# EAGLE design music_visualizer (EAGLE 9.5.1)
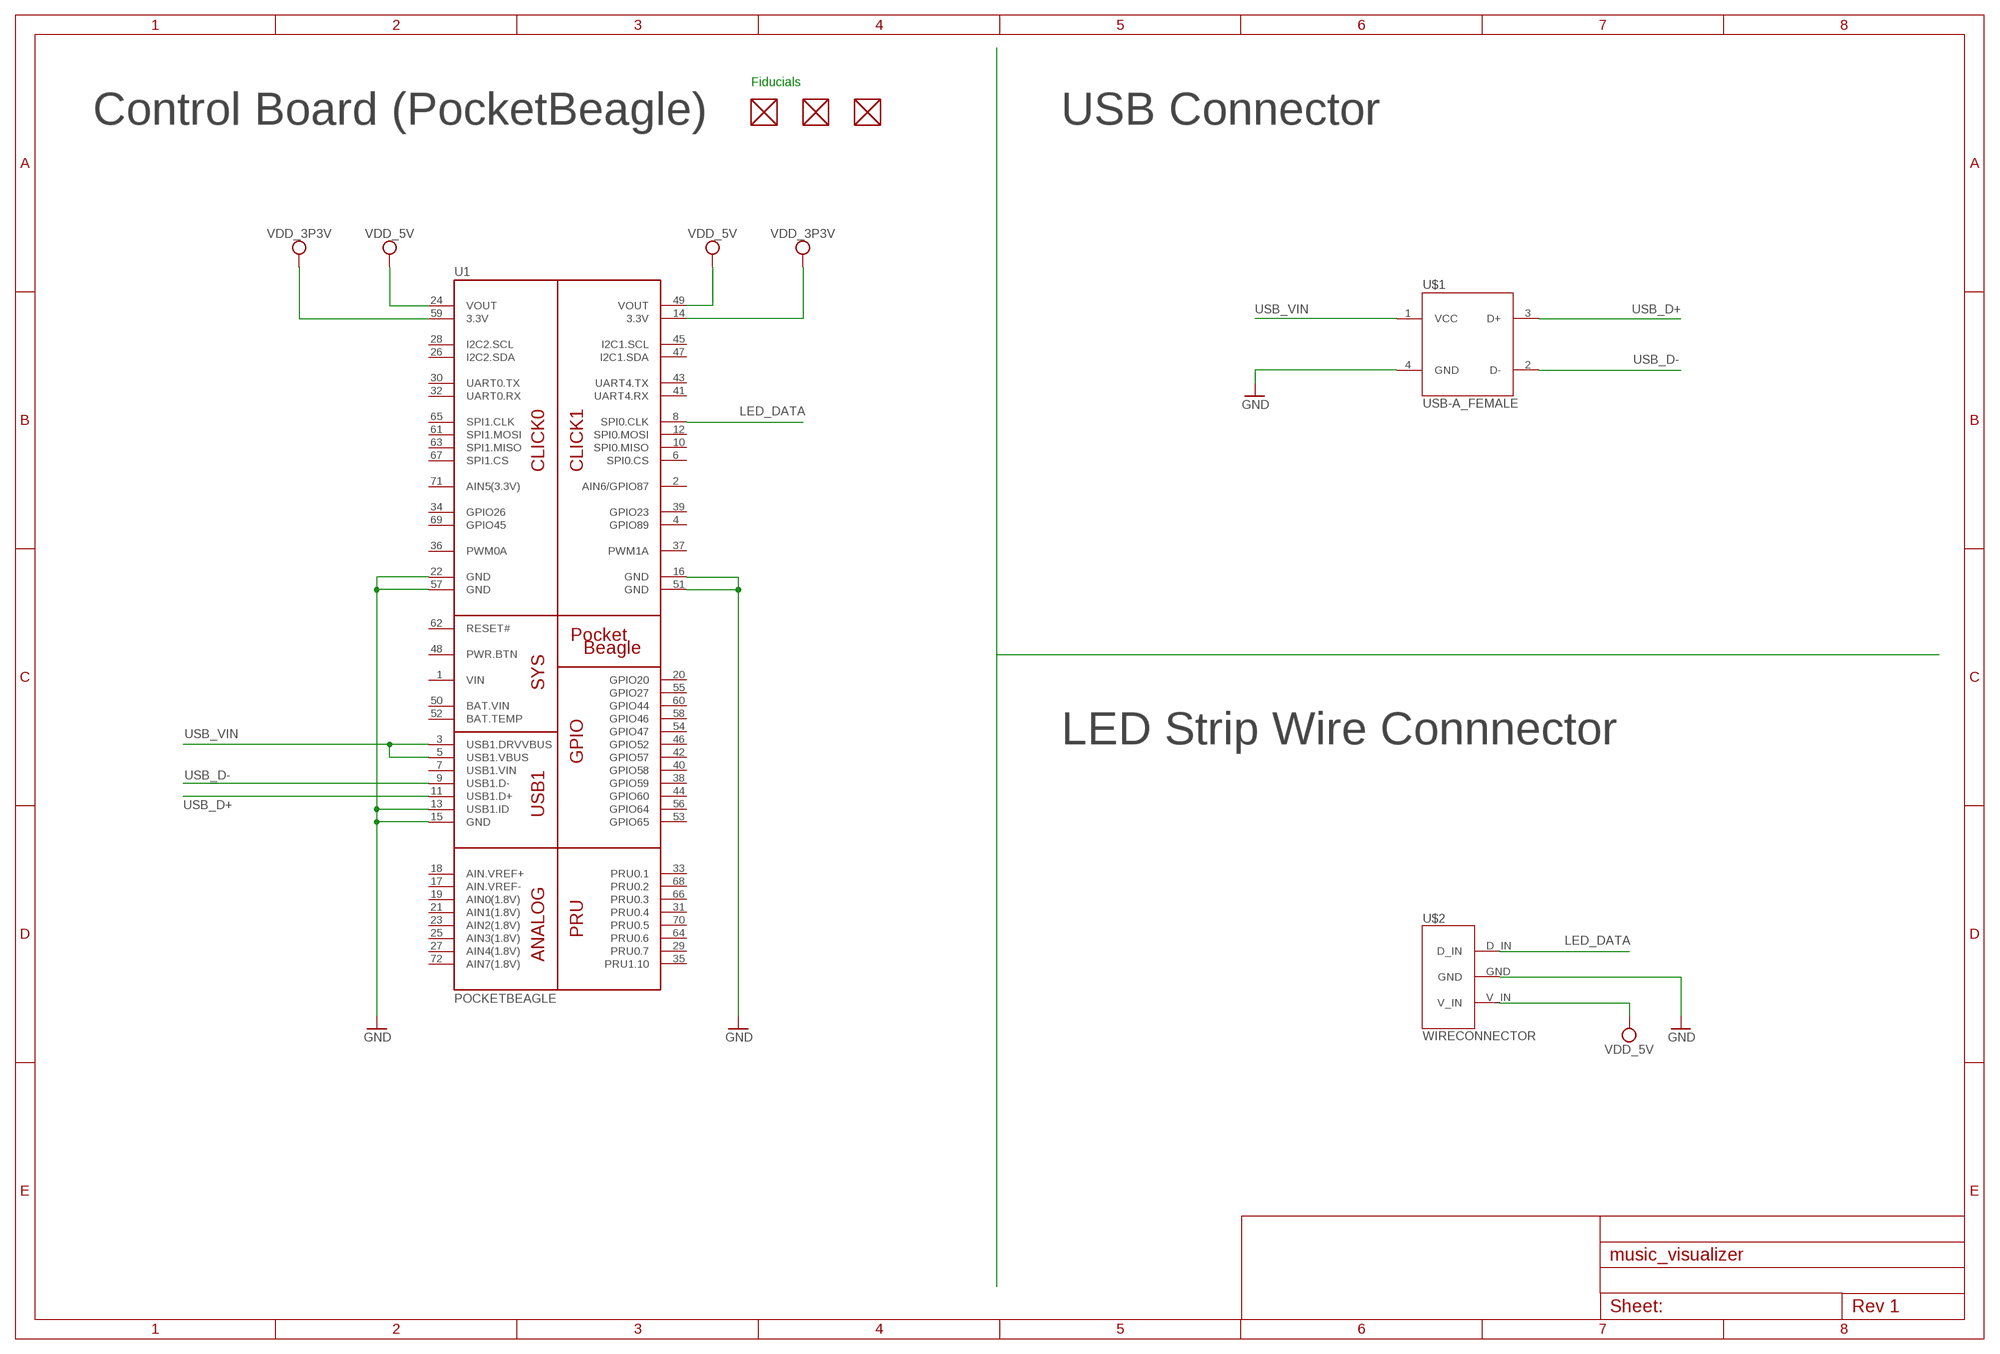
[diagram p0: schematic, sheet 1]

## Parts
FUD1  FIDUCIAL  [FIDUCIAL_40MIL]
FUD2  FIDUCIAL  [FIDUCIAL_40MIL]
FUD3  FIDUCIAL  [FIDUCIAL_40MIL]
U1  POCKETBEAGLE  [POCKETBEAGLE]
U$1  USB-A_FEMALE  [USB-A_FEMALE]
U$2  WIRECONNECTOR  [WIRECONNECTOR]

## Nets
GND: U1.13(USB1.ID) U1.15(GND) U1.16(GND) U1.22(GND) U1.51(GND) U1.57(GND) U$1.4(GND) U$2.GND
LED_DATA: U1.8(SPI0.CLK) U$2.D_IN
USB_D+: U1.11(USB1.D+) U$1.3(D+)
USB_D-: U1.9(USB1.D-) U$1.2(D-)
USB_VIN: U1.3(USB1.DRVVBUS) U1.5(USB1.VBUS) U$1.1(VCC)
VDD_3P3V: U1.14(3.3V) U1.59(3.3V)
VDD_5V: U1.24(VOUT) U1.49(VOUT) U$2.V_IN
Unconnected: FUD1.P$1 FUD2.P$1 FUD3.P$1 U1.2(AIN6/GPIO87) U1.4(GPIO89) U1.6(SPI0.CS) U1.7(USB1.VIN) U1.10(SPI0.MISO) U1.12(SPI0.MOSI) U1.17(AIN.VREF-) U1.18(AIN.VREF+) U1.19(AIN0(1.8V)) U1.20(GPIO20) U1.21(AIN1(1.8V)) U1.23(AIN2(1.8V)) U1.25(AIN3(1.8V)) U1.26(I2C2.SDA) U1.27(AIN4(1.8V)) U1.28(I2C2.SCL) U1.29(PRU0.7) U1.30(UART0.TX) U1.31(PRU0.4) U1.32(UART0.RX) U1.33(PRU0.1) U1.34(GPIO26) U1.35(PRU1.10) U1.36(PWM0A) U1.37(PWM1A) U1.38(GPIO59) U1.39(GPIO23) U1.40(GPIO58) U1.41(UART4.RX) U1.42(GPIO57) U1.43(UART4.TX) U1.44(GPIO60) U1.45(I2C1.SCL) U1.46(GPIO52) U1.47(I2C1.SDA) U1.48(PWR.BTN) U1.52(BAT.TEMP) U1.53(GPIO65) U1.54(GPIO47) U1.55(GPIO27) U1.56(GPIO64) U1.58(GPIO46) U1.60(GPIO44) U1.61(SPI1.MOSI) U1.62(RESET#) U1.63(SPI1.MISO) U1.64(PRU0.6) U1.65(SPI1.CLK) U1.66(PRU0.3) U1.67(SPI1.CS) U1.68(PRU0.2) U1.69(GPIO45) U1.70(PRU0.5) U1.71(AIN5(3.3V)) U1.72(AIN7(1.8V))

## Notes on the sheet
- Fiducials
- Control Board (PocketBeagle) | USB Connector
- LED Strip Wire Connnector

## Power pins joined to a net without a drawn wire
BAT.VIN: U1.50(BAT.VIN)
VIN: U1.1(VIN)

## Library data of the parts
FUD1-FUD3 = music_visualizer:FIDUCIAL
U1 = music_visualizer:POCKETBEAGLE
U$1 = music_visualizer:USB-A_FEMALE
U$2 = music_visualizer:WIRECONNECTOR

## Net classes
0 default: width 0.254 mm, drill 0.305 mm, clearance 0.254 mm

## Board
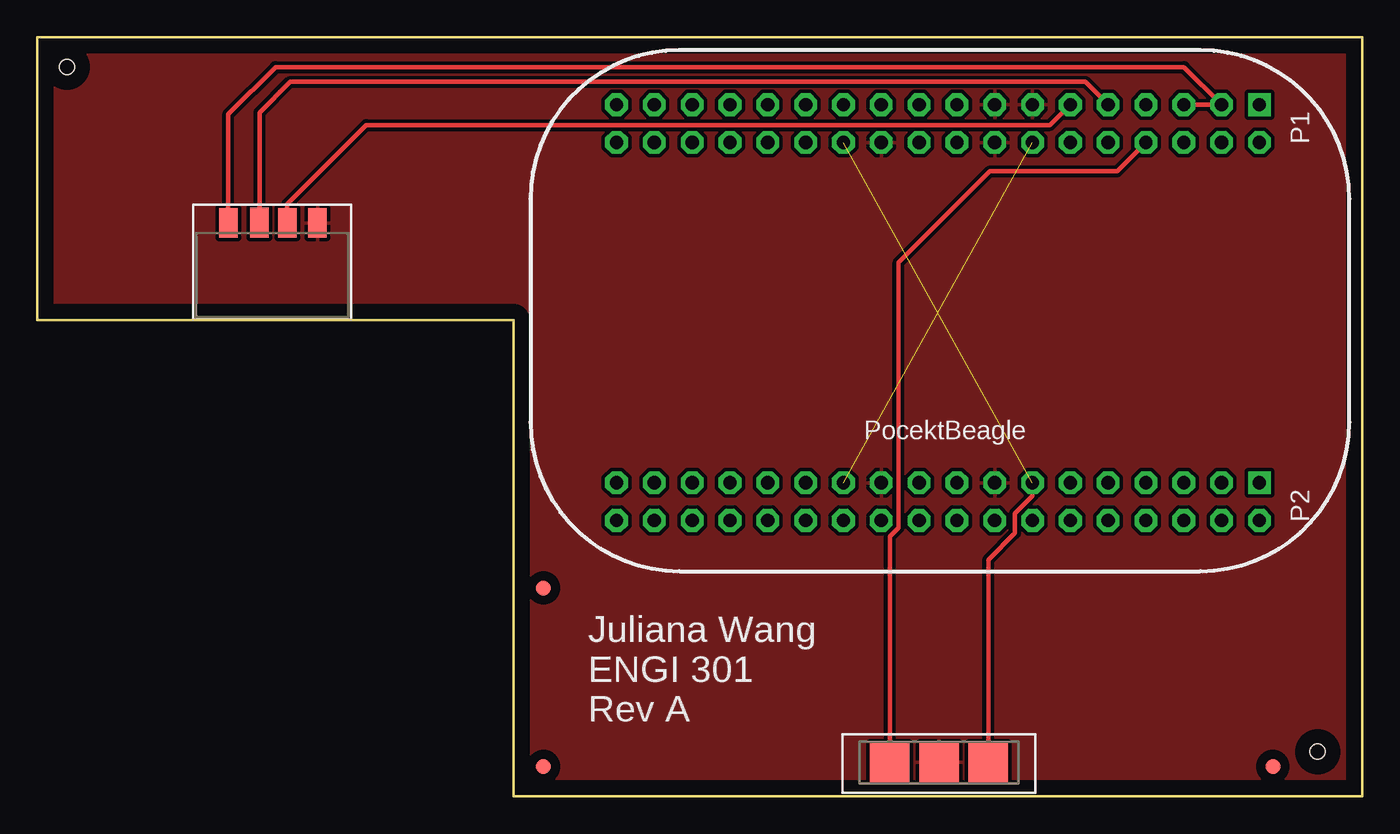
[diagram p1: board, top side]
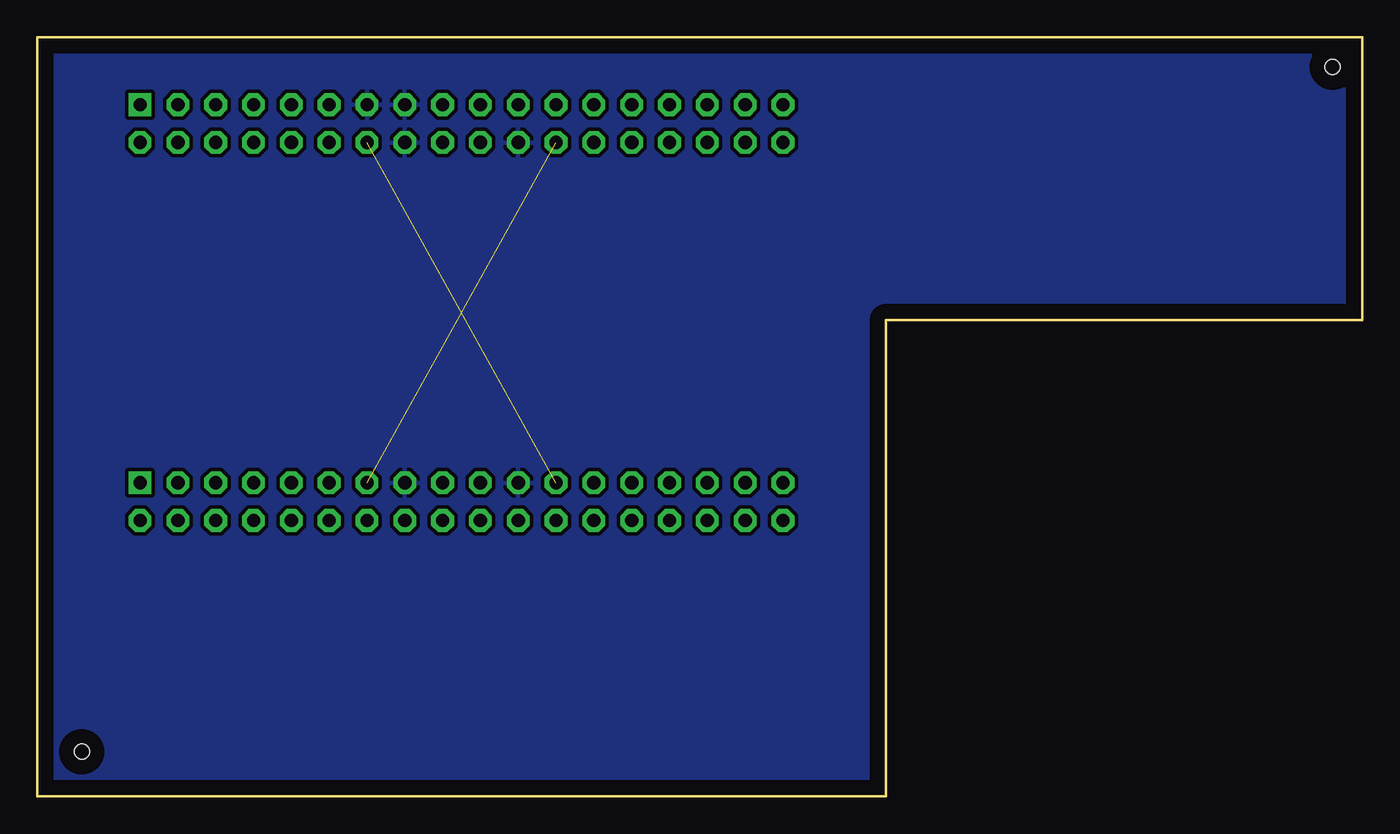
[diagram p2: board, bottom side, seen from below]

Size 89 x 51 mm. Coordinates in mm from the lower left corner, seen from the top.
Outline: 0,32 0,51 89,51 89,0 32,0 32,32 0,32
Copper layers (1*16): Top 0.035mm / dielectric 1.5mm / Bottom 0.035mm
Design rules "default": minimum track width 6mil, minimum drill 0.35mm, track to track 6mil, track to pad 6mil, pad to pad 6mil, via to via 6mil, smd to smd 6mil, copper to edge 40mil, drill to drill 6mil, minimum pad ring 10mil, minimum via ring 8mil, stop-mask expansion 4mil, vias tented up to drill 0mil, thermal gap 10mil
Holes 1 mm at 2,49 86,3

### Footprints (pad centres in the part's own frame; a part is rotated, then mirrored left to right if it is on the bottom)
FIDUCIAL_40MIL = smd 1.016 x 1.016: P$1 0,0
POCKETBEAGLE = drill 0.889 pad 1.524 square: 1 5.91,3.53; 37 5.91,28.93 | drill 0.889 pad 1.524 octagon: 2 5.91,6.07; 3 8.45,3.53; 4 8.45,6.07; 5 10.99,3.53; 6 10.99,6.07; 7 13.53,3.53; 8 13.53,6.07; 9 16.07,3.53; 10 16.07,6.07; 11 18.61,3.53; 12 18.61,6.07; 13 21.15,3.53; 14 21.15,6.07; 15 23.69,3.53; 16 23.69,6.07; 17 26.23,3.53; 18 26.23,6.07; 19 28.77,3.53; 20 28.77,6.07; 21 31.31,3.53; 22 31.31,6.07; 23 33.85,3.53; 24 33.85,6.07; 25 36.39,3.53; 26 36.39,6.07; 27 38.93,3.53; 28 38.93,6.07; 29 41.47,3.53; 30 41.47,6.07; 31 44.01,3.53; 32 44.01,6.07; 33 46.55,3.53; 34 46.55,6.07; 35 49.09,3.53; 36 49.09,6.07; 38 5.91,31.47; 39 8.45,28.93; 40 8.45,31.47; 41 10.99,28.93; 42 10.99,31.47; 43 13.53,28.93; 44 13.53,31.47; 45 16.07,28.93; 46 16.07,31.47; 47 18.61,28.93; 48 18.61,31.47; 49 21.15,28.93; 50 21.15,31.47; 51 23.69,28.93; 52 23.69,31.47; 53 26.23,28.93; 54 26.23,31.47; 55 28.77,28.93; 56 28.77,31.47; 57 31.31,28.93; 58 31.31,31.47; 59 33.85,28.93; 60 33.85,31.47; 61 36.39,28.93; 62 36.39,31.47; 63 38.93,28.93; 64 38.93,31.47; 65 41.47,28.93; 66 41.47,31.47; 67 44.01,28.93; 68 44.01,31.47; 69 46.55,28.93; 70 46.55,31.47; 71 49.09,28.93; 72 49.09,31.47
USB-A_FEMALE = smd 1.25 x 2: 1 -0.04,5.13; 2 2.06,5.16; 3 3.92,5.13; 4 5.95,5.13
WIRECONNECTOR = smd 2.65 x 2.65: D_IN 1.27,1.27; GND 4.572,1.27; V_IN 7.874,1.27

### Placement (x,y rotation side)
FUD1  34,14 0 top
FUD2  34,2 0 top
FUD3  83,2 0 top
U1  88,50 180 top
U$1  12.87,33.39 0 top
U$2  56,1 0 top

### Tracks (layer width: path | path; a pad name or v marks a point on that pad's centre or on a via)
GND
  pour Top: 0,32 0,51 89,51 89,0 32,0 32,32
  pour Top: 0,32 0,51 89,51 89,0 32,0 32,32 1,32
  pour Bottom: 0,32 0,51 89,51 89,0 32,0 32,32
LED_DATA
  Top 0.305: U$2.D_IN 57.27,17.46 57.86,18.05 57.86,35.86 64,42 72.54,42 U1.8
USB_D+
  Top 0.305: U$1.3 16.79,39.79 22.1,45.1 68.02,45.1 U1.11
USB_D-
  Top 0.305: U$1.2 14.93,45.93 17,48 70.4,48 U1.9
USB_VIN
  Top 0.305: U$1.1 12.83,45.83 16,49 77.02,49 U1.3 U1.5
VDD_3P3V  (1 unrouted)
VDD_5V  (1 unrouted)
  Top 0.305: U$2.V_IN 63.87,15.87 65.68,17.68 65.68,19.01 66.85,20.18 U1.49

### Text on the board
tPlace: Juliana Wang / ENGI 301 / Rev A